# EAGLE design board-v1 (EAGLE 9.1.3)
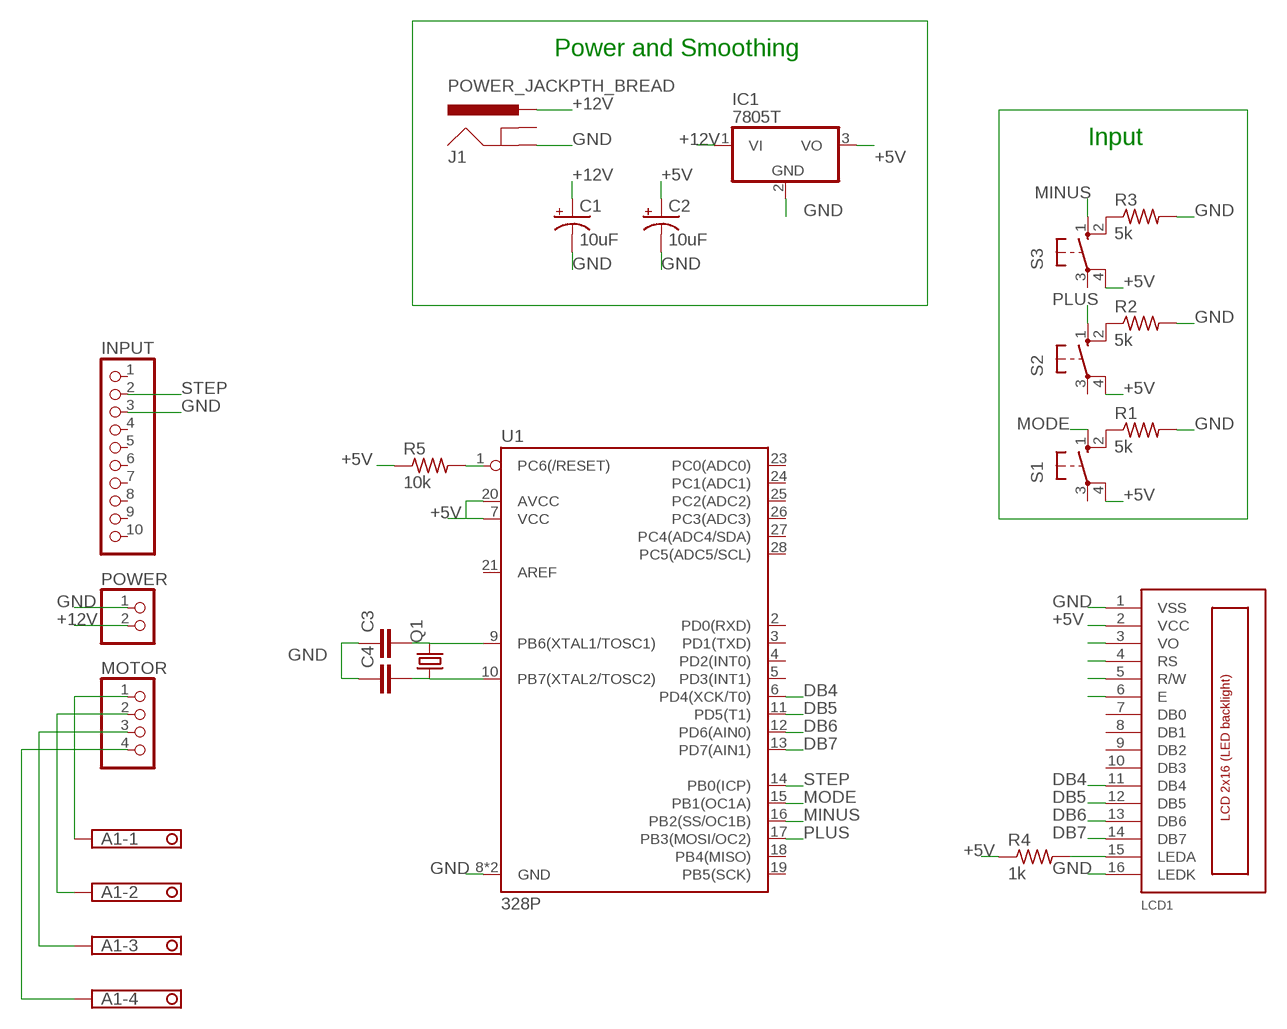
[diagram p0: schematic, sheet 1]

## Parts
A1  TERMINAL-BLOCK-3.5MM-4-PIN-LONG-PAD  [TERMINAL-BLOCK-4-PIN-3.5MM-LONG-PAD]
C1  10uF  10UF-POLAR-RADIAL-2.5MM-25V-20%  [CPOL-RADIAL-2.5MM-5MM]
C2  10uF  10UF-POLAR-RADIAL-2.5MM-25V-20%  [CPOL-RADIAL-2.5MM-5MM]
C3  C-EU025-024X044  [C025-024X044]
C4  C-EU025-024X044  [C025-024X044]
IC1  7805T  [TO220H]
INPUT  PINHD-1X10  [1X10]
J1  POWER_JACKPTH_BREAD  [POWER_JACK_PTH_BREAD]
LCD1  LCD_2X16_SIL  [HY-1602F]
MOTOR  PINHD-1X4  [1X04]
POWER  PINHD-1X2  [1X02]
Q1  CRYSTALHC49S  [HC49/S]
R1  5k  R-US_0207/7  [0207/7]
R2  5k  R-US_0207/7  [0207/7]
R3  5k  R-US_0207/7  [0207/7]
R4  1k  R-US_0207/7  [0207/7]
R5  10k  R-US_0207/7  [0207/7]
S1  40-XX  [B3F-40XX]
S2  40-XX  [B3F-40XX]
S3  40-XX  [B3F-40XX]
U1  328P  ATMEGA328P_PDIP  [DIP28]

## Nets
+5V: C2.1(+) IC1.3(VO) LCD1.2(VCC) R4.1 R5.1 S1.4(P1) S2.4(P1) S3.4(P1) U1.7(VCC) U1.20(AVCC)
+12V: C1.1(+) IC1.1(VI) J1.PWR POWER.2
DB4: LCD1.11(DB4) U1.6(PD4(XCK/T0))
DB5: LCD1.12(DB5) U1.11(PD5(T1))
DB6: LCD1.13(DB6) U1.12(PD6(AIN0))
DB7: LCD1.14(DB7) U1.13(PD7(AIN1))
GND: C1.2(-) C2.2(-) C3.1 C4.1 IC1.2(GND) INPUT.3 J1.GND LCD1.1(VSS) LCD1.16(LEDK) POWER.1 R1.2 R2.2 R3.2 U1.8(GND) U1.22(GND)
MINUS: S3.1(S) U1.16(PB2(SS/OC1B))
MODE: S1.1(S) U1.15(PB1(OC1A))
N$1: C4.2 Q1.1 U1.10(PB7(XTAL2/TOSC2))
N$2: LCD1.3(VO)
N$4: R5.2 U1.1(PC6(/RESET))
N$5: LCD1.4(RS)
N$6: LCD1.5(R/W)
N$7: LCD1.6(E)
N$8: LCD1.15(LEDA) R4.2
N$9: A1.1 MOTOR.1
N$10: A1.2 MOTOR.2
N$11: A1.3 MOTOR.3
N$12: A1.4 MOTOR.4
N$13: C3.2 Q1.2 U1.9(PB6(XTAL1/TOSC1))
N$14: R1.1 S1.2(S1)
N$15: R2.1 S2.2(S1)
N$16: R3.1 S3.2(S1)
PLUS: S2.1(S) U1.17(PB3(MOSI/OC2))
STEP: INPUT.2 U1.14(PB0(ICP))
Unconnected: INPUT.1 INPUT.4 INPUT.5 INPUT.6 INPUT.7 INPUT.8 INPUT.9 INPUT.10 J1.GNDBREAK LCD1.7(DB0) LCD1.8(DB1) LCD1.9(DB2) LCD1.10(DB3) S1.3(P) S2.3(P) S3.3(P) U1.2(PD0(RXD)) U1.3(PD1(TXD)) U1.4(PD2(INT0)) U1.5(PD3(INT1)) U1.18(PB4(MISO)) U1.19(PB5(SCK)) U1.21(AREF) U1.23(PC0(ADC0)) U1.24(PC1(ADC1)) U1.25(PC2(ADC2)) U1.26(PC3(ADC3)) U1.27(PC4(ADC4/SDA)) U1.28(PC5(ADC5/SCL))

## Notes on the sheet
- Power and Smoothing
- Input

## Library data of the parts
A1 = Rembrandt Electronics - Terminal Block 3-5mm v1-0:TERMINAL-BLOCK-3.5MM-4-PIN: Terminal Block 3.5mm Pitch: 3,5 mm Number of pins: 4 Created by Rembrandt Electronics www.rembrandtelectronics.com
C1 C2 = SparkFun-Capacitors:10UF-POLAR: 10.0µF polarized capacitors A capacitor is a passive two-terminal electrical component used to store electrical energy temporarily in an electric field.; PROD_ID: CAP-08440
C3 C4 = rcl:C-EU: CAPACITOR, European symbol; SPICEPREFIX: C
IC1 = linear:78*: Positive VOLTAGE REGULATOR Source: http://cache.national.com/ds/LM/LM78L05.pdf http://www.fairchildsemi.com/ds/LM/LM7805.pdf
INPUT = pinhead:PINHD-1X10: PIN HEADER
J1 = SparkFun-Connectors:POWER_JACK: Power Jack Connector This is the standard 5.5mm barrel jack for power. The PTH is the most common, proven, reliable, footprint. The Slot footprint only works if the mill layer is transmitted to the PCB fab house so be warned. Here are the connectors we sell at SparkFun: DC Barrel Power Jack/Connector <https://www.sparkfun.com/products/119> (PRT-00119) DC Barrel Power Jack/Connector (SMD) <https://www.sparkfun.com/products/12748> (PRT-12748) DC Barrel Jack Adapter - Breadboard Compatible <https://www.sparkfun.com/products/10811> (PRT-10811) It is used on this SparkFun product (and many, many others): SparkFun RedBoard - Programmed with Arduino <https://www.sparkfun.com/products/12757> (DEV-12757) Also, if you need a mating power supply or connector, please check these out: Wall Adapter Power Supply - 9VDC 650mA <https://www.sparkfun.com/products/298> (TOL-00298) DC Barrel Jack Adapter - Male <https://www.sparkfun.com/products/10287> (PRT-10287); PROD_ID: PRT-10811
LCD1 = lcd_2x16_led_backlight:LCD_2X16_SIL
MOTOR = pinhead:PINHD-1X4: PIN HEADER
POWER = pinhead:PINHD-1X2: PIN HEADER
Q1 = crystal:CRYSTAL: CRYSTAL; OC_FARNELL: 1667008; OC_NEWARK: unknown
R1-R5 = resistor:R-US_: RESISTOR, American symbol
S1-S3 = switch-omron:40-XX: OMRON SWITCH; MF: OMRON COMPONENTS USA; MPN: B3F-4000; OC_FARNELL: 176434; OC_NEWARK: 36K3105
U1 = SparkFun-IC-Microcontroller:ATMEGA328P_PDIP: Atmel 328P Through hole ATMEGA328P uC used in the Arduino 32kb flash, 1k EEPROM, 2k SRAM Datasheet <http://www.sparkfun.com/datasheets/Components/SMD/ATMega328.pdf> SparkFun Products Storefront component: AVR 28 Pin 20MHz 32K 6A/D - ATMega328P <https://www.sparkfun.com/products/9061> (COM-09061) SparkFun Simon Says - Through-Hole Soldering Kit <https://www.sparkfun.com/products/10547> (KIT-10547) SparkFun Learn to Solder - Simon Says <https://www.sparkfun.com/products/13708> (KIT-13708) SparkFun BigTime Watch Kit <https://www.sparkfun.com/products/11734> (KIT-11734) SparkFun ClockIt <https://www.sparkfun.com/products/10930> (KIT-10930) SparkFun Serial Enabled LCD Kit <https://www.sparkfun.com/products/10097> (LCD-10097) SparkFun Simon Tilts - Through Hole Soldering Kit <https://www.sparkfun.com/products/12634> (KIT-12634) SparkFun Frequency Counter Kit <https://www.sparkfun.com/products/10140> (KIT-10140) FabFM Radio Kit <https://www.sparkfun.com/products/11043> (KIT-11043) SparkFun Binary Blaster Kit <https://www.sparkfun.com/products/12037> (KIT-12037) SparkFun Metro-Gnome <https://www.sparkfun.com/products/9236> (KIT-09236) ATmega328 with Arduino Optiboot (Uno) <https://www.sparkfun.com/products/10524> (DEV-10524); PROD_ID: IC-09136

## Board
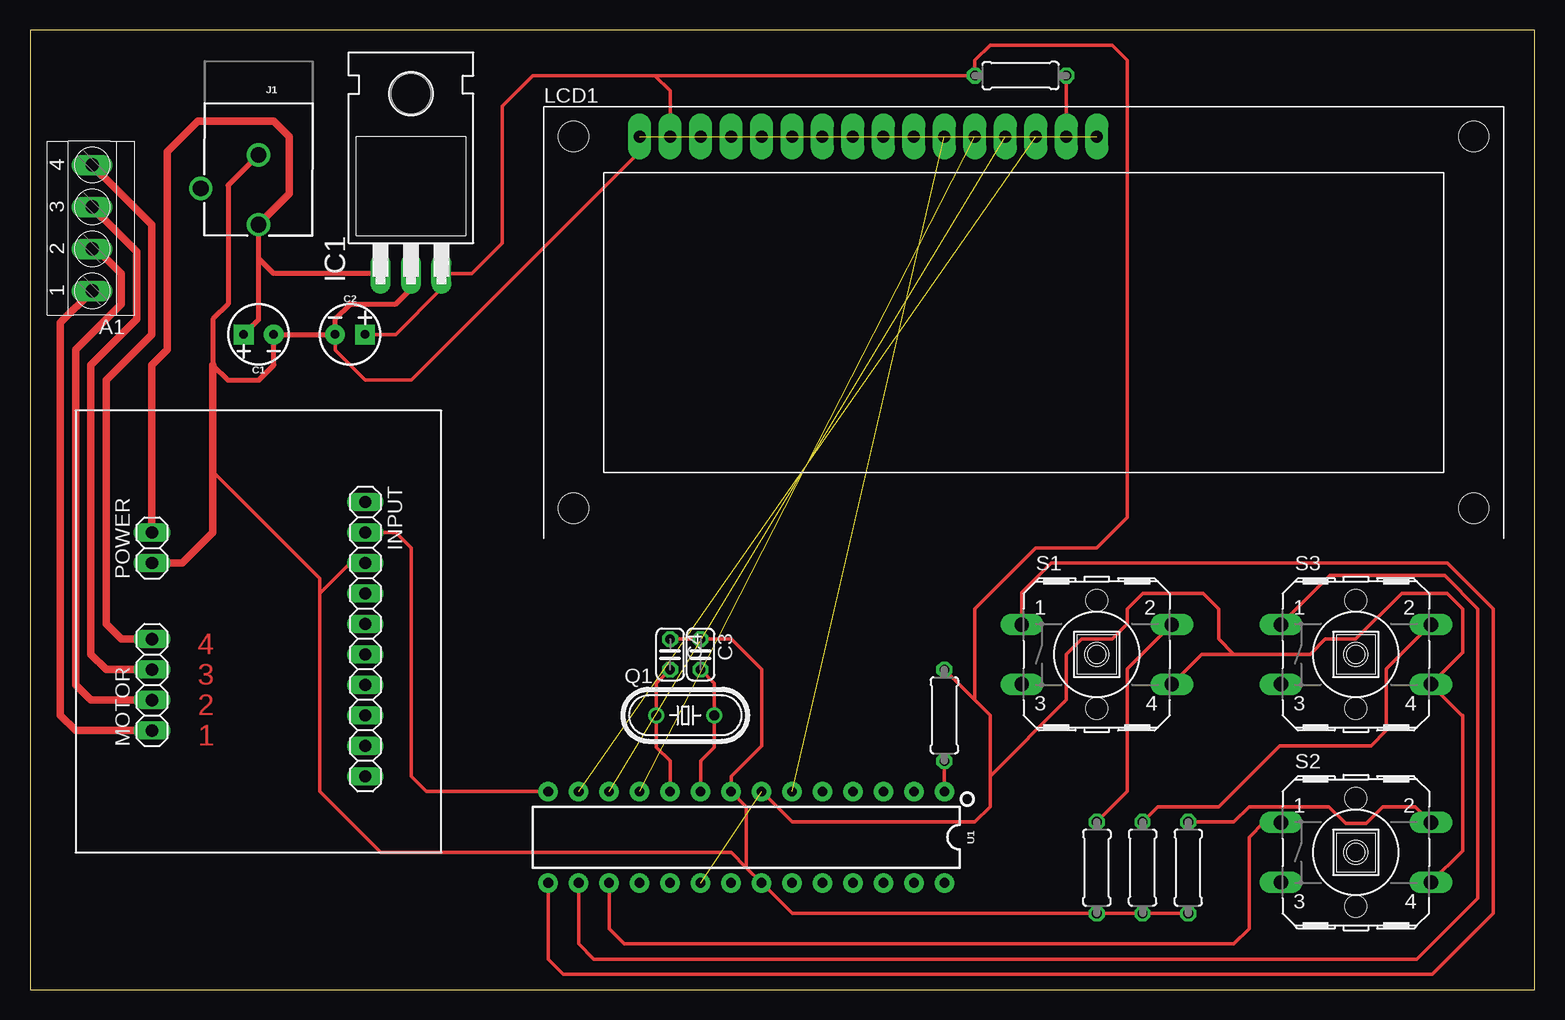
[diagram p1: board, top side]
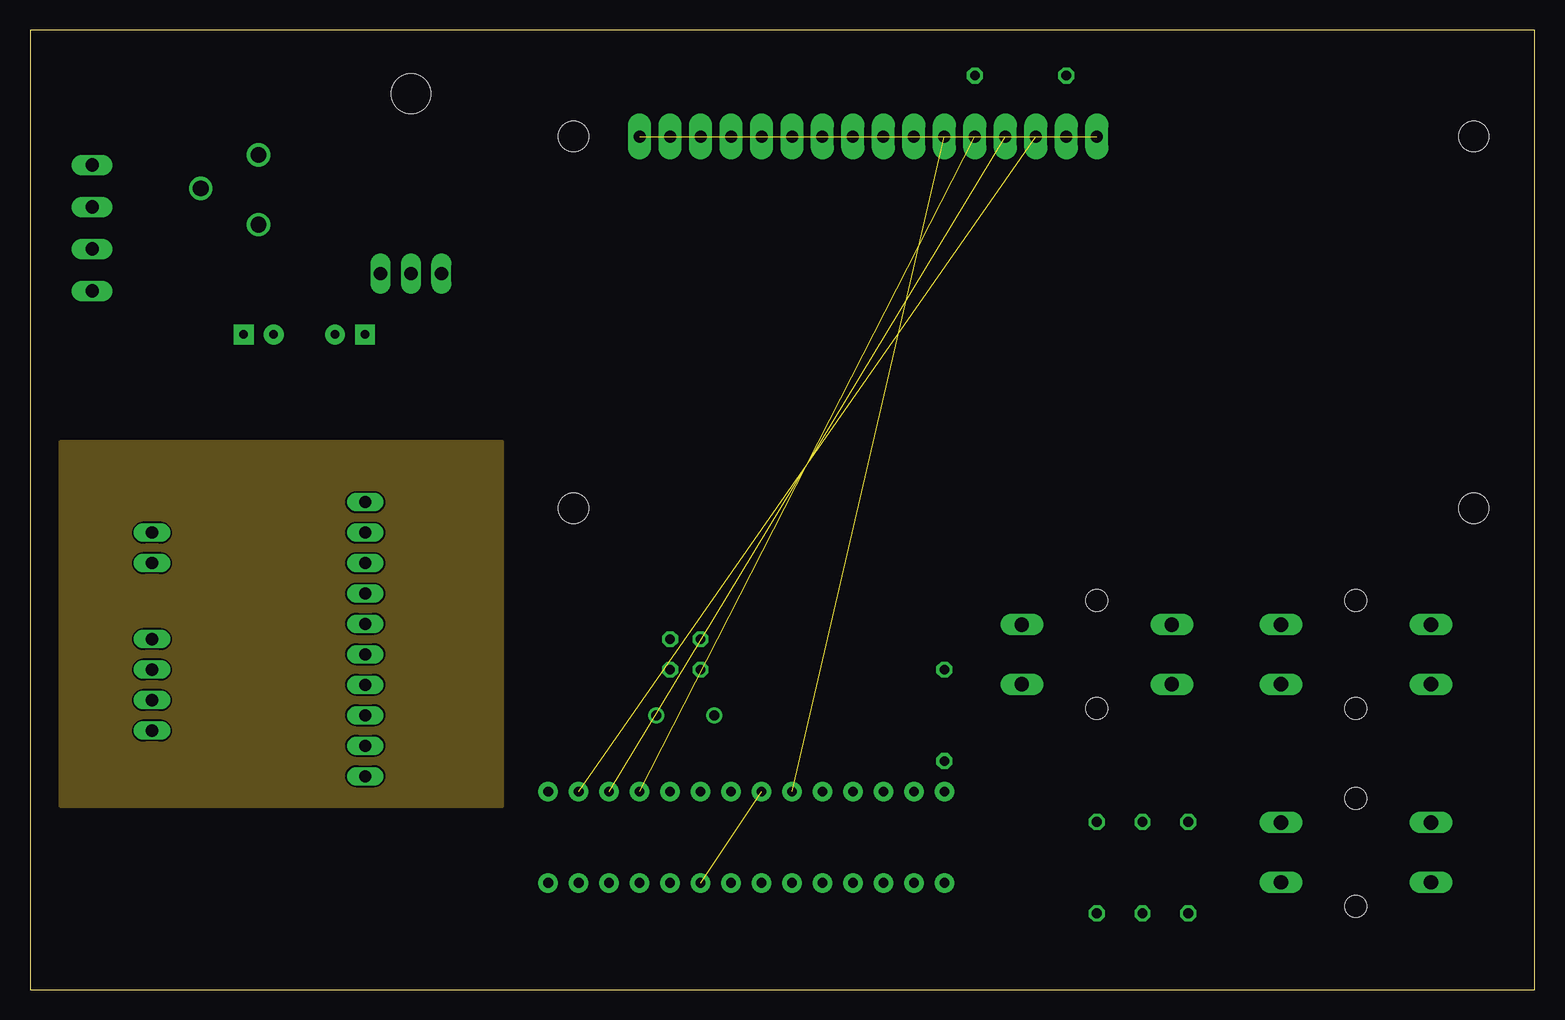
[diagram p2: board, inner layer Route2]
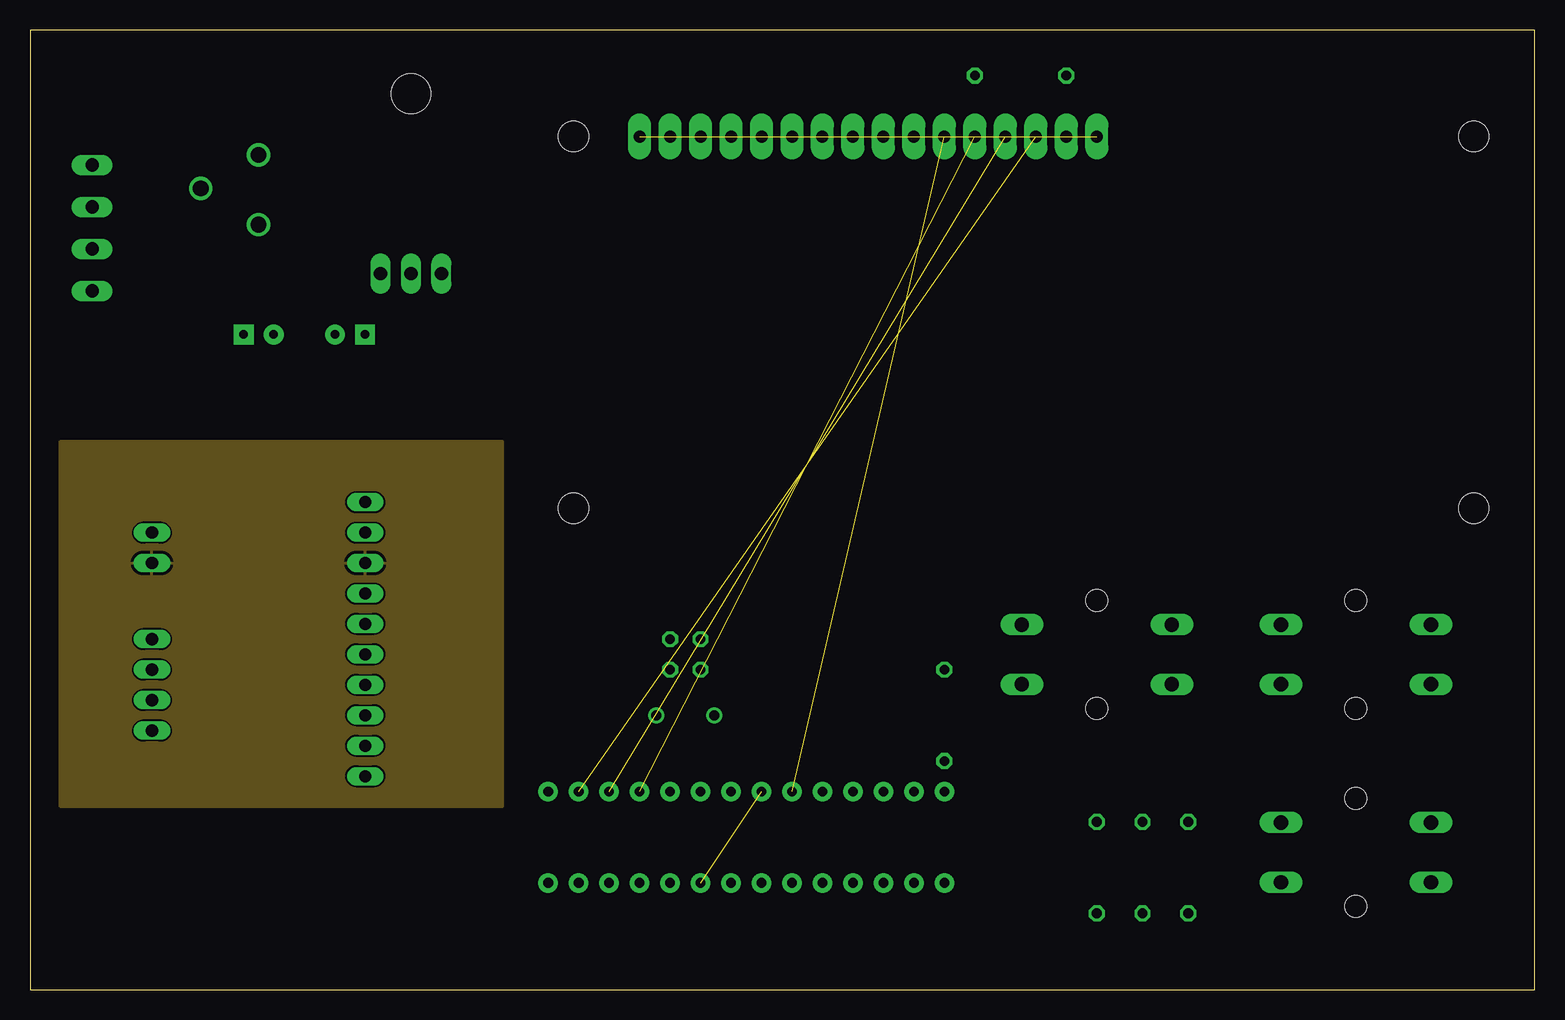
[diagram p3: board, inner layer Route15]

Size 125.4 x 80 mm. Coordinates in mm from the lower left corner, seen from the top.
Outline: 0,0 125.4,0 125.4,80 0,80 0,0
Copper layers (1*16): Top 0.035mm / dielectric 1.5mm / Bottom 0.035mm
Design rules "default": minimum track width 6mil, minimum drill 0.35mm, track to track 6mil, track to pad 6mil, pad to pad 6mil, via to via 6mil, smd to smd 6mil, copper to edge 40mil, drill to drill 6mil, minimum pad ring 10mil, minimum via ring 8mil, stop-mask expansion 4mil, vias tented up to drill 0mil, thermal gap 10mil

### Footprints (pad centres in the part's own frame; a part is rotated, then mirrored left to right if it is on the bottom)
TERMINAL-BLOCK-4-PIN-3.5MM-LONG-PAD = drill 1.1 pad 1.7 long: 1 -5.25,-0.1; 2 -1.75,-0.1; 3 1.75,-0.1; 4 5.25,-0.1
CPOL-RADIAL-2.5MM-5MM = drill 0.7 pad 1.651 square: 1 1.25,0 | drill 0.7 pad 1.651: 2 -1.25,0
C025-024X044 = drill 0.813 octagon: 1 -1.27,0; 2 1.27,0
TO220H = drill 1.118 long: 1 -2.54,-10.16; 2 0,-10.16; 3 2.54,-10.16 | hole 3.302: 0,4.826
1X10 = drill 1.016 long: 1 -11.43,0; 2 -8.89,0; 3 -6.35,0; 4 -3.81,0; 5 -1.27,0; 6 1.27,0; 7 3.81,0; 8 6.35,0; 9 8.89,0; 10 11.43,0
POWER_JACK_PTH_BREAD = drill 1.3: GND 0,7.9; GNDBREAK 4.8,10.7; PWR 0,13.7
HY-1602F = drill 1 pad 1.93 long: 1 2.54,0; 2 5.08,0; 3 7.62,0; 4 10.16,0; 5 12.7,0; 6 15.24,0; 7 17.78,0; 8 20.32,0; 9 22.86,0; 10 25.4,0; 11 27.94,0; 12 30.48,0; 13 33.02,0; 14 35.56,0; 15 38.1,0; 16 40.64,0 | hole 2.5: -2.96,0; 72.04,0; -2.96,-31; 72.04,-31
1X04 = drill 1.016 long: 1 -3.81,0; 2 -1.27,0; 3 1.27,0; 4 3.81,0
1X02 = drill 1.016 long: 1 -1.27,0; 2 1.27,0
HC49/S = drill 0.813: 1 -2.413,0; 2 2.413,0
0207/7 = drill 0.813 octagon: 1 -3.81,0; 2 3.81,0
B3F-40XX = drill 1.194 long: 1 -6.248,2.489; 2 6.248,2.489; 3 -6.248,-2.489; 4 6.248,-2.489 | hole 1.803: 0,-4.496; 0,4.496
DIP28 = drill 0.813 pad 1.626: 1 -16.51,-3.81; 2 -13.97,-3.81; 3 -11.43,-3.81; 4 -8.89,-3.81; 5 -6.35,-3.81; 6 -3.81,-3.81; 7 -1.27,-3.81; 8 1.27,-3.81; 9 3.81,-3.81; 10 6.35,-3.81; 11 8.89,-3.81; 12 11.43,-3.81; 13 13.97,-3.81; 14 16.51,-3.81; 15 16.51,3.81; 16 13.97,3.81; 17 11.43,3.81; 18 8.89,3.81; 19 6.35,3.81; 20 3.81,3.81; 21 1.27,3.81; 22 -1.27,3.81; 23 -3.81,3.81; 24 -6.35,3.81; 25 -8.89,3.81; 26 -11.43,3.81; 27 -13.97,3.81; 28 -16.51,3.81

### Placement (x,y rotation side)
A1  5.08,63.5 90 top
C1  19.05,54.61 180 top
C2  26.67,54.61 0 top
C3  55.88,27.94 270 top
C4  53.34,27.94 270 top
IC1  31.75,69.85 0 top
INPUT  27.94,29.21 270 top
J1  19.05,77.47 179.9 top
LCD1  48.26,71.12 0 top
MOTOR  10.16,25.4 90 top
POWER  10.16,36.83 90 top
Q1  54.61,22.86 0 top
R1  88.9,10.16 270 top
R2  96.52,10.16 270 top
R3  92.71,10.16 270 top
R4  82.55,76.2 0 top
R5  76.2,22.86 270 top
S1  88.9,27.94 0 top
S2  110.49,11.43 0 top
S3  110.49,27.94 0 top
U1  59.69,12.7 180 top

### Tracks (layer width: path | path; a pad name or v marks a point on that pad's centre or on a via)
+5V  (1 unrouted)
  Top 0.305: C2.1 30.48,54.61 34.29,58.42 IC1.3 36.83,59.69 39.37,62.23 39.37,73.66 41.91,76.2 52.07,76.2 | S2.4 119.38,11.58 119.38,22.86 119.33,22.86 S3.4 119.38,28.09 119.38,31.75 118.11,33.02 114.3,33.02 110.49,29.21 107.95,29.21 106.68,27.94 100.33,27.94 | S1.4 97.64,27.94 99.06,27.94 100.33,27.94 | U1.7 63.5,13.97 78.74,13.97 80.01,15.24 80.01,17.78 | 80.01,17.78 80.01,21.59 80.01,22.86 78.74,24.13 | 78.74,24.13 R5.1 | 100.33,27.94 99.06,29.21 99.06,31.75 97.79,33.02 92.71,33.02 91.44,31.75 91.44,30.48 90.17,29.21 87.63,29.21 86.36,27.94 86.36,24.13 80.01,17.78 | 78.74,24.13 78.74,31.75 83.82,36.83 88.9,36.83 91.44,39.37 91.44,77.47 90.17,78.74 80.01,78.74 78.74,77.47 R4.1 52.07,76.2 | LCD1.2 53.34,74.93 52.07,76.2
+12V
  Top 0.406: J1.PWR 19.03,60.96 | 19.03,60.96 19.03,55.84 C1.1 | 19.03,60.96 20.3,59.69 IC1.1
  Top 0.61: J1.PWR 21.59,66.33 21.59,71.12 20.32,72.39 13.97,72.39 11.43,69.85 11.43,53.34 10.16,52.07 POWER.2
DB4  (1 unrouted)
DB5  (1 unrouted)
DB6  (1 unrouted)
DB7  (1 unrouted)
GND  (1 unrouted)
  Top 0.305: 59.69,10.16 U1.22 63.5,6.35 R1.2 R2.2 R3.2 | 59.69,10.16 59.69,15.24 U1.8 58.42,17.78 60.96,20.32 60.96,26.67 58.42,29.21 C3.1 C4.1 | C2.2 25.42,53.32 27.94,50.8 31.75,50.8 50.8,69.85 LCD1.1 | 59.69,10.16 58.42,11.43 29.21,11.43 24.13,16.51 24.13,33.02 | 24.13,33.02 24.13,34.29 15.24,43.18 | INPUT.3 26.67,35.56 24.13,33.02
  Top 0.406: J1.GND 16.51,67.04 16.51,57.15 15.24,55.88 15.24,52.07 16.51,50.8 19.05,50.8 20.32,52.07 20.3,52.09 C1.2 C2.2 25.42,55.86 25.4,55.88 26.67,57.15 30.48,57.15 31.75,58.42 IC1.2
  Top 0.61: POWER.1 11.43,35.56 12.7,35.56 15.24,38.1 15.24,43.18 15.24,52.07
  pour Route15: 2.54,45.72 39.37,45.72 39.37,15.24 2.54,15.24
MINUS
  Top 0.305: S3.1 108.32,34.51 117.89,34.51 120.65,31.75 120.65,7.62 115.57,2.54 46.99,2.54 45.72,3.81 U1.16
MODE
  Top 0.305: 95.19,35.56 95.25,35.56 | 95.25,35.56 118.11,35.56 121.92,31.75 121.92,6.35 116.84,1.27 44.45,1.27 43.18,2.54 U1.15 | S1.1 82.65,33.12 85.09,35.56 95.25,35.56
N$1
  Top 0.305: U1.10 53.34,19.05 52.2,20.19 Q1.1 52.2,25.53 C4.2
N$4
  Top 0.305: R5.2 U1.1
N$8
  Top 0.305: R4.2 LCD1.15
N$9
  Top 0.61: MOTOR.1 3.81,21.59 2.54,22.86 2.54,55.61 A1.1
N$10
  Top 0.61: MOTOR.2 5.08,24.13 3.81,25.4 3.81,53.34 7.62,57.15 7.62,59.69 5.56,61.75 A1.2
N$11
  Top 0.61: MOTOR.3 6.35,26.67 5.08,27.94 5.08,52.07 8.89,55.88 8.89,61.54 A1.3
N$12
  Top 0.61: MOTOR.4 7.62,29.21 6.35,30.48 6.35,50.8 10.16,54.61 10.16,63.77 A1.4
N$13
  Top 0.305: U1.9 55.88,19.05 57.02,20.19 Q1.2 57.02,25.53 C3.2
N$14
  Top 0.305: S1.2 91.44,26.72 91.44,16.51 R1.1
N$15
  Top 0.305: R2.1 100.33,13.97 101.6,15.24 108.25,15.24 109.63,13.86 111.35,13.86 112.73,15.24 115.42,15.24 S2.2
N$16
  Top 0.305: R3.1 93.98,15.24 99.06,15.24 104.14,20.32 111.76,20.32 113.03,21.59 113.03,26.72 S3.2
PLUS
  Top 0.305: S2.1 102.82,13.92 101.6,12.7 101.6,5.08 100.33,3.81 49.53,3.81 48.26,5.08 U1.17
STEP
  Top 0.305: 26.67,38.1 INPUT.2 30.48,38.1 31.75,36.83 31.75,17.78 33.02,16.51 U1.14
VCC
  pour Route2: 2.54,45.72 39.37,45.72 39.37,15.24 2.54,15.24

### Text on the board
Top: 4 | 3 | 2 | 1